# EAGLE design hydrogen_sensors_board_v2 (EAGLE 8.3.2)
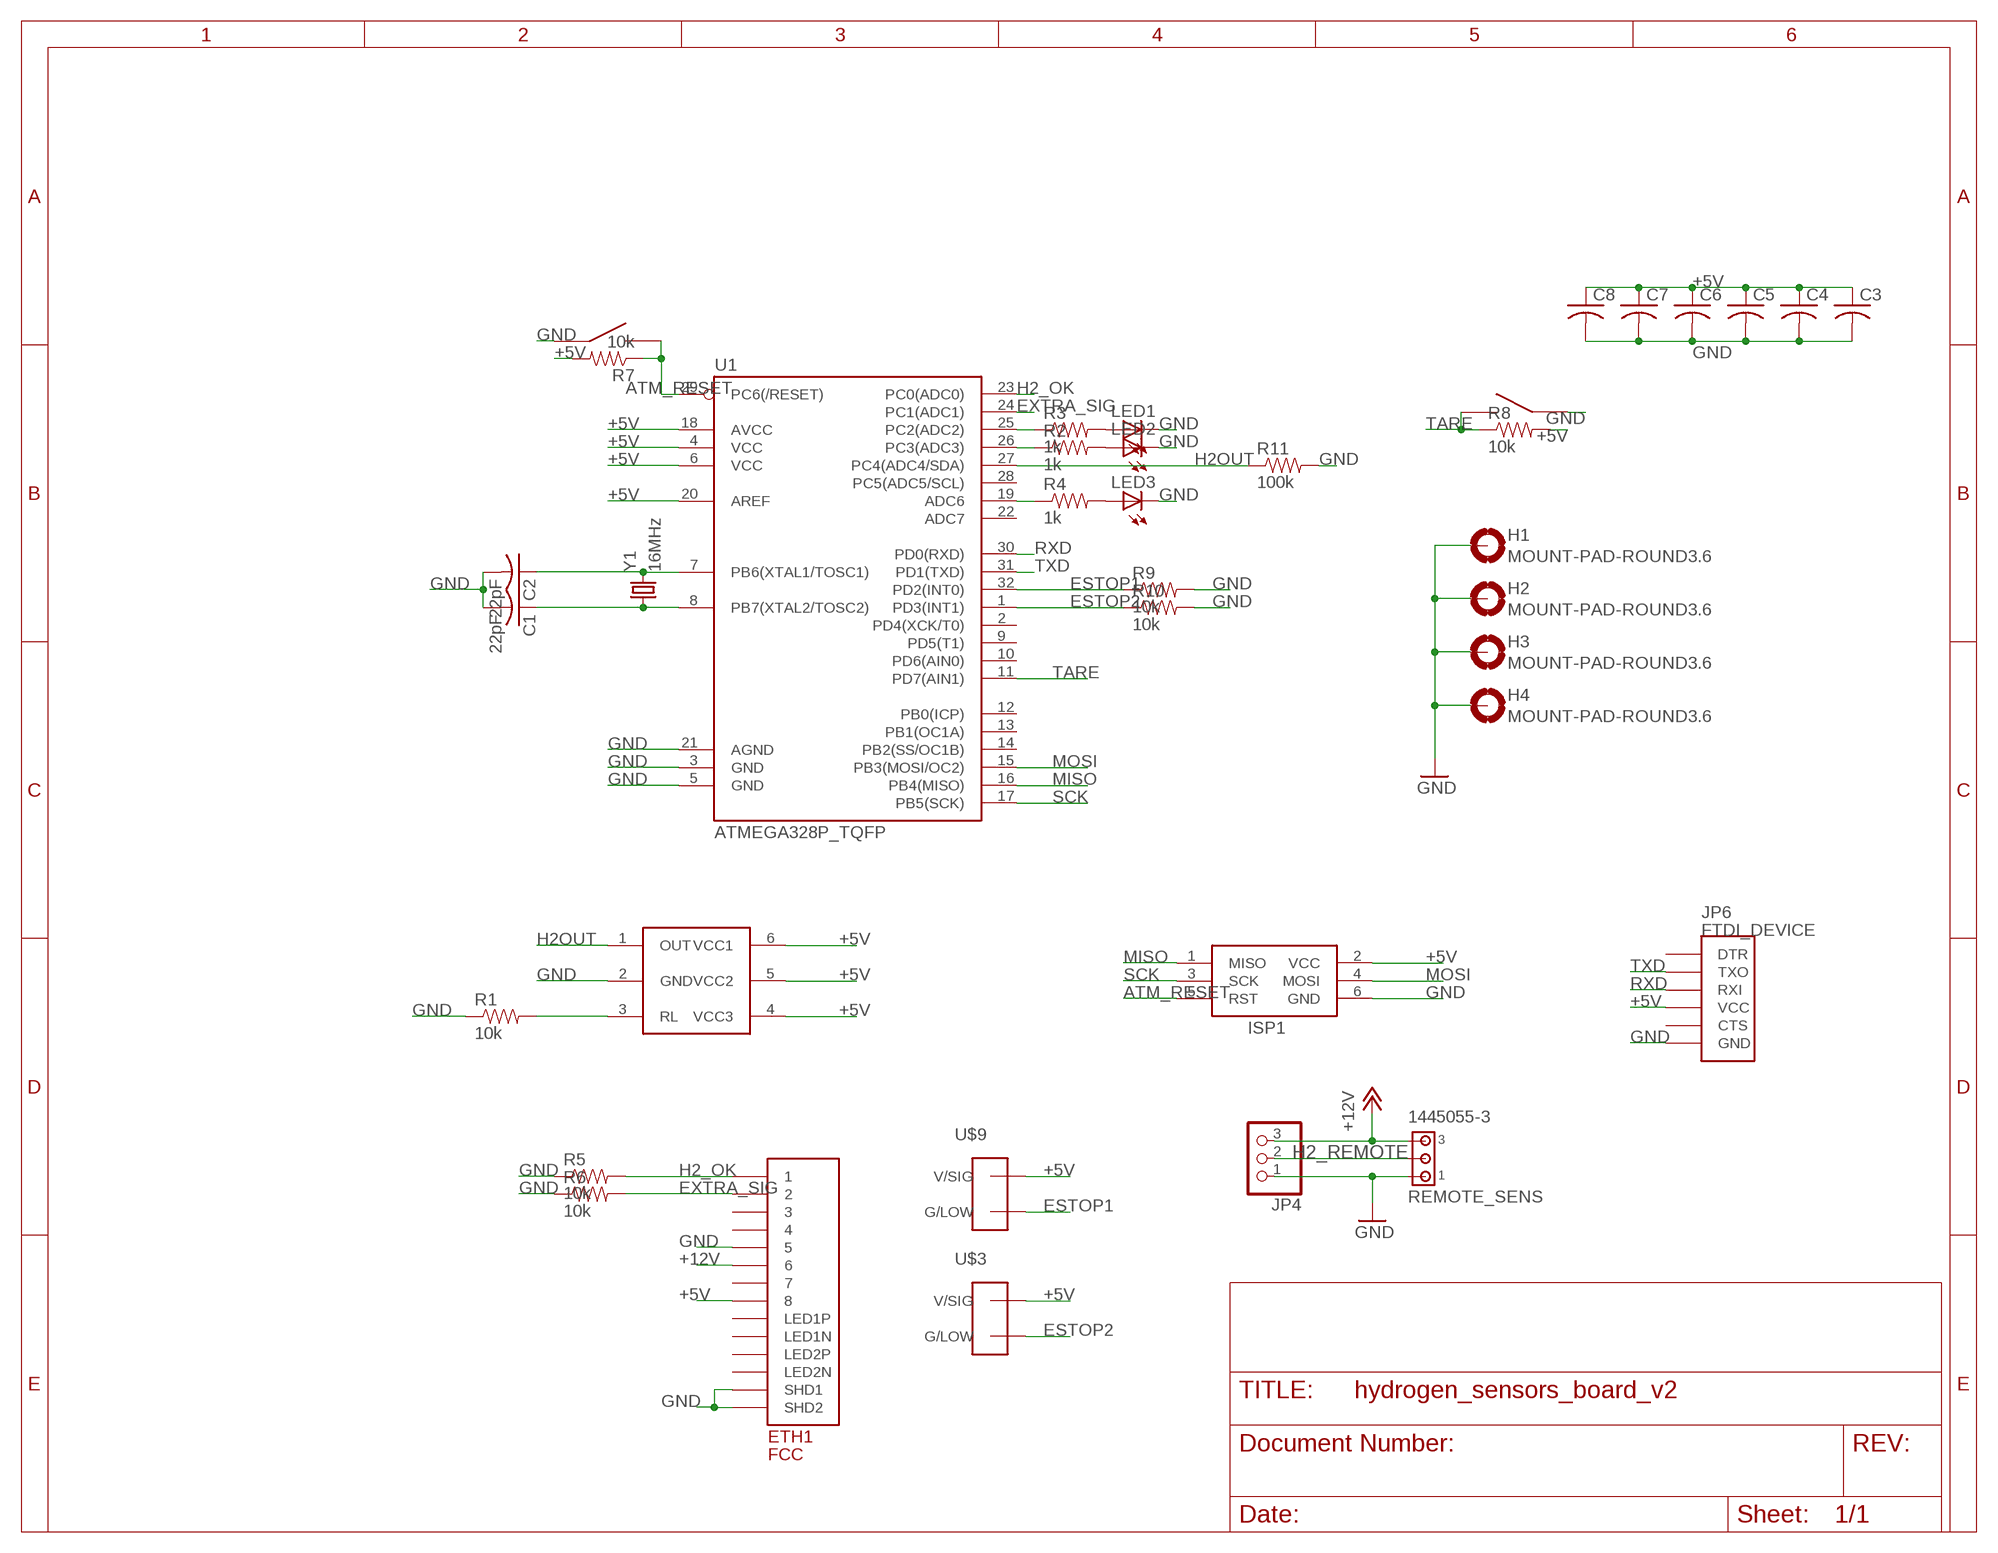
[diagram p0: schematic, sheet 1]

## Parts
C1  22pF  C-USC0603K  [C0603K]
C2  22pF  C-USC0603K  [C0603K]
C3  C-USC0603  [C0603]
C4  C-USC0603  [C0603]
C5  C-USC0603  [C0603]
C6  C-USC0603  [C0603]
C7  C-USC0603  [C0603]
C8  C-USC0603  [C0603]
ETH1  FCC  ETHERNET  [A122645-ND]
H1  MOUNT-PAD-ROUND3.6  [3,6-PAD]
H2  MOUNT-PAD-ROUND3.6  [3,6-PAD]
H3  MOUNT-PAD-ROUND3.6  [3,6-PAD]
H4  MOUNT-PAD-ROUND3.6  [3,6-PAD]
ISP1  AVRISP-BOX  [AVRISP-BOX]
JP4  PINHD-1X3  [1X03]
JP6  FTDI_DEVICE  [FTDI_DEVICE_SIDE]
LED1  LEDCHIPLED_0805  [CHIPLED_0805]
LED2  LEDCHIPLED_0805  [CHIPLED_0805]
LED3  LEDCHIPLED_0805  [CHIPLED_0805]
R1  10k  RESISTOR0603-RES  [0603-RES]
R2  1k  RESISTOR0603-RES  [0603-RES]
R3  1k  RESISTOR0603-RES  [0603-RES]
R4  1k  RESISTOR0603-RES  [0603-RES]
R5  10k  RESISTOR0603-RES  [0603-RES]
R6  10k  RESISTOR0603-RES  [0603-RES]
R7  10k  RESISTOR0603-RES  [0603-RES]
R8  10k  RESISTOR0603-RES  [0603-RES]
R9  10k  RESISTOR0603-RES  [0603-RES]
R10  10k  RESISTOR0603-RES  [0603-RES]
R11  100k  RESISTOR0603-RES  [0603-RES]
REMOTE_SENS  1445055-3  [1445055-3]
U1  ATMEGA328P_TQFP  [TQFP32-08]
U$1  MQ-8MQ-8  [MQ-8]
U$2  EG4621CT-ND  [EG4621CT-ND]
U$3  TE770966  [2X1-MATE-N-LOCK]
U$9  TE770966  [2X1-MATE-N-LOCK]
U$10  EG4621CT-ND  [EG4621CT-ND]
Y1  16MHz  CRYSTALHC49US  [HC49US]

## Nets
+5V: C3.1 C4.1 C5.1 C6.1 C7.1 C8.1 ETH1.P$8 ISP1.2(VCC) JP6.P$4(VCC) R7.2 R8.2 U1.4(VCC) U1.6(VCC) U1.18(AVCC) U1.20(AREF) U$1.4(VCC3) U$1.5(VCC2) U$1.6(VCC1) U$3.CIRCUIT1(V/SIG) U$9.CIRCUIT1(V/SIG)
+12V: ETH1.P$6 JP4.3 REMOTE_SENS.3
ATM_RESET: ISP1.5(RST) R7.1 U1.29(PC6(/RESET)) U$10.P$3 U$10.P$4
ESTOP1: R9.1 U1.32(PD2(INT0)) U$9.CIRCUIT2(G/LOW)
ESTOP2: R10.1 U1.1(PD3(INT1)) U$3.CIRCUIT2(G/LOW)
EXTRA_SIG: ETH1.P$2 R6.2 U1.24(PC1(ADC1))
GND: C1.2 C2.2 C3.2 C4.2 C5.2 C6.2 C7.2 C8.2 ETH1.P$5 ETH1.P$13(SHD1) ETH1.P$14(SHD2) H1.B3,6(MOUNT) H2.B3,6(MOUNT) H3.B3,6(MOUNT) H4.B3,6(MOUNT) ISP1.6(GND) JP4.1 JP6.P$6(GND) LED1.C LED2.C LED3.C R1.1 R5.1 R6.1 R9.2 R10.2 R11.2 REMOTE_SENS.1 U1.3(GND) U1.5(GND) U1.21(AGND) U$1.2(GND) U$2.P$1 U$2.P$2 U$10.P$1 U$10.P$2
H2_OK: ETH1.P$1 R5.2 U1.23(PC0(ADC0))
H2_REMOTE: JP4.2 REMOTE_SENS.2
H2OUT: R11.1 U1.27(PC4(ADC4/SDA)) U$1.1(OUT)
MISO: ISP1.1(MISO) U1.16(PB4(MISO))
MOSI: ISP1.4(MOSI) U1.15(PB3(MOSI/OC2))
N$1: C2.1 U1.7(PB6(XTAL1/TOSC1)) Y1.2
N$2: R1.2 U$1.3(RL)
N$3: C1.1 U1.8(PB7(XTAL2/TOSC2)) Y1.1
N$4: R3.1 U1.25(PC2(ADC2))
N$5: R2.1 U1.26(PC3(ADC3))
N$6: R4.1 U1.19(ADC6)
N$7: LED1.A R3.2
N$8: LED2.A R2.2
N$9: LED3.A R4.2
RXD: JP6.P$3(RXI) U1.30(PD0(RXD))
SCK: ISP1.3(SCK) U1.17(PB5(SCK))
TARE: R8.1 U1.11(PD7(AIN1)) U$2.P$3 U$2.P$4
TXD: JP6.P$2(TXO) U1.31(PD1(TXD))
Unconnected: ETH1.P$3 ETH1.P$4 ETH1.P$7 ETH1.P$9(LED1N) ETH1.P$10(LED1P) ETH1.P$11(LED2N) ETH1.P$12(LED2P) JP6.P$1(DTR) JP6.P$5(CTS) U1.2(PD4(XCK/T0)) U1.9(PD5(T1)) U1.10(PD6(AIN0)) U1.12(PB0(ICP)) U1.13(PB1(OC1A)) U1.14(PB2(SS/OC1B)) U1.22(ADC7) U1.28(PC5(ADC5/SCL))

## Library data of the parts
C1-C8 = adafruit:C-US: CAPACITOR, American symbol
ETH1 = ETHERNET:ETHERNET: Ethernet port with 2 leds. digikey number A122645-ND
H1-H4 = holes:MOUNT-PAD-ROUND: MOUNTING PAD, round
ISP1 = adafruit:AVRISP: AVR ISP HEADER Standard 6 pin header for AVR programming
JP4 = pinhead:PINHD-1X3: PIN HEADER
JP6 = SparkFun-Connectors:FTDI_DEVICE: Connector which mates to FTDI basic or FTDI cable.
LED1-LED3 = adafruit:LED: LED OSRAM: - CHIPLED LG R971, LG N971, LY N971, LG Q971, LY Q971, LO R971, LY R971 LH N974, LH R974 LS Q976, LO Q976, LY Q976 LO Q996 - Hyper CHIPLED LW Q18S LB Q993, LB Q99A, LB R99A - SideLED LS A670, LO A670, LY A670, LG A670, LP A670 LB A673, LV A673, LT A673, LW A673 LH A674 LY A675 LS A676, LA A676, LO A676, LY A676, LW A676 LS A679, LY A679, LG A679 - Hyper Micro SIDELED® LS Y876, LA Y876, LO Y876, LY Y876 LT Y87S - SmartLED LW L88C, LW L88S LB L89C, LB L89S, LG L890 LS L89K, LO L89K, LY L89K LS L896, LA L896, LO L896, LY L896 - TOPLED LS T670, LO T670, LY T670, LG T670, LP T670 LSG T670, LSP T670, LSY T670, LOP T670, LYG T670 LG T671, LOG T671, LSG T671 LB T673, LV T673, LT T673, LW T673 LH T674 LS T676, LA T676, LO T676, LY T676, LB T676, LH T676, LSB T676, LW T676 LB T67C, LV T67C, LT T67C, LS T67K, LO T67K, LY T67K, LW E67C LS E67B, LA E67B, LO E67B, LY E67B, LB E67C, LV E67C, LT E67C LW T67C LS T679, LY T679, LG T679 LS T770, LO T770, LY T770, LG T770, LP T770 LB T773, LV T773, LT T773, LW T773 LH T774 LS E675, LA E675, LY E675, LS T675 LS T776, LA T776, LO T776, LY T776, LB T776 LHGB T686 LT T68C, LB T68C - Hyper Mini TOPLED® LB M676 - Mini TOPLED Santana® LG M470 LS M47K, LO M47K, LY M47K Source: http://www.osram.convergy.de/
R1 R5 R6 R9 R10 = SparkFun-Passives:RESISTOR: Resistor Basic schematic elements and footprints for 0603, 1206, and PTH resistors.
R2-R4 R7 R8 R11 = SparkFun-Resistors:RESISTOR: Resistor Basic schematic elements and footprints for 0603, 1206, and PTH resistors.
REMOTE_SENS = con-amp:1445055-3: Micro MATE-N-LOK Connectors grid 1.5 mm Source: ENG_CD_1445055_A.pdf
U1 = SparkFun-DigitalIC:ATMEGA328P_TQFP; PROD_ID: IC-09069
U$1 = donny_library:MQ-8
U$2 U$10 = EG4621CT-ND:EG4621CT-ND: surface mount push putton digikey number EG4621CT-ND
U$3 U$9 = Shell2013:TE770966
Y1 = SparkFun-FreqCtrl:CRYSTAL: Various standard crystals. Proven footprints.

## Board
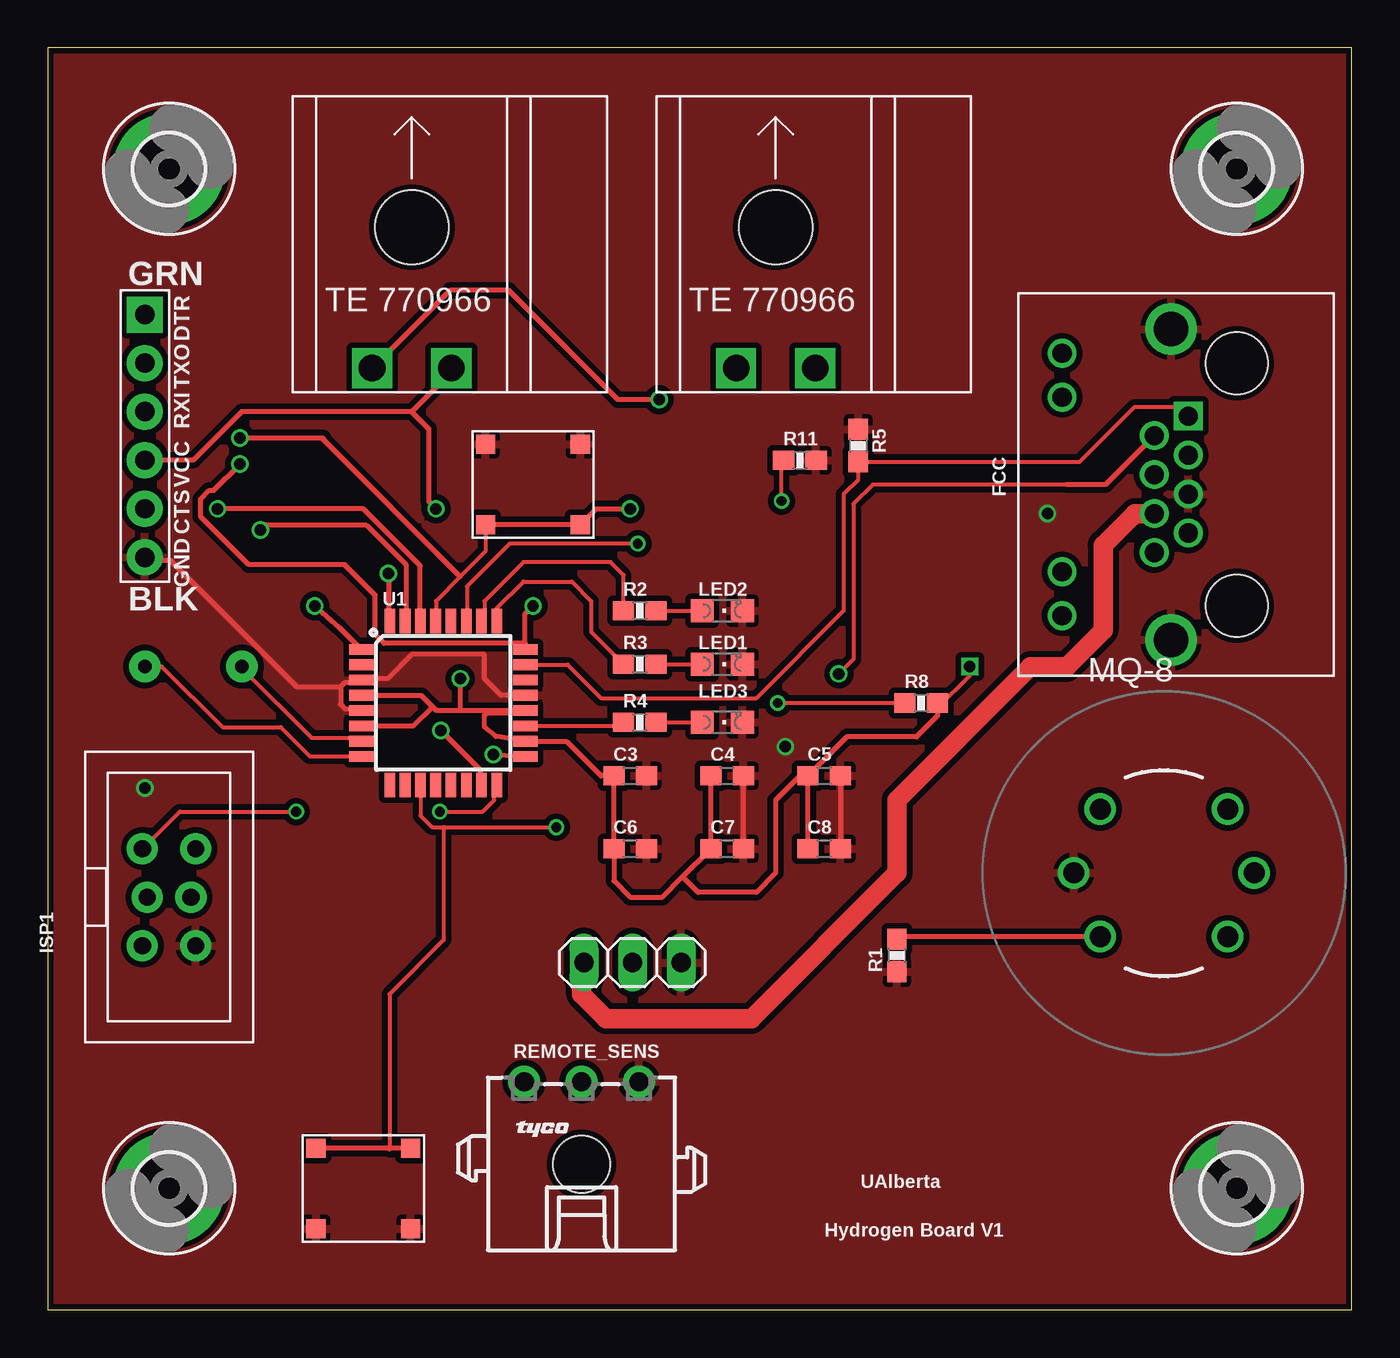
[diagram p1: board, top side]
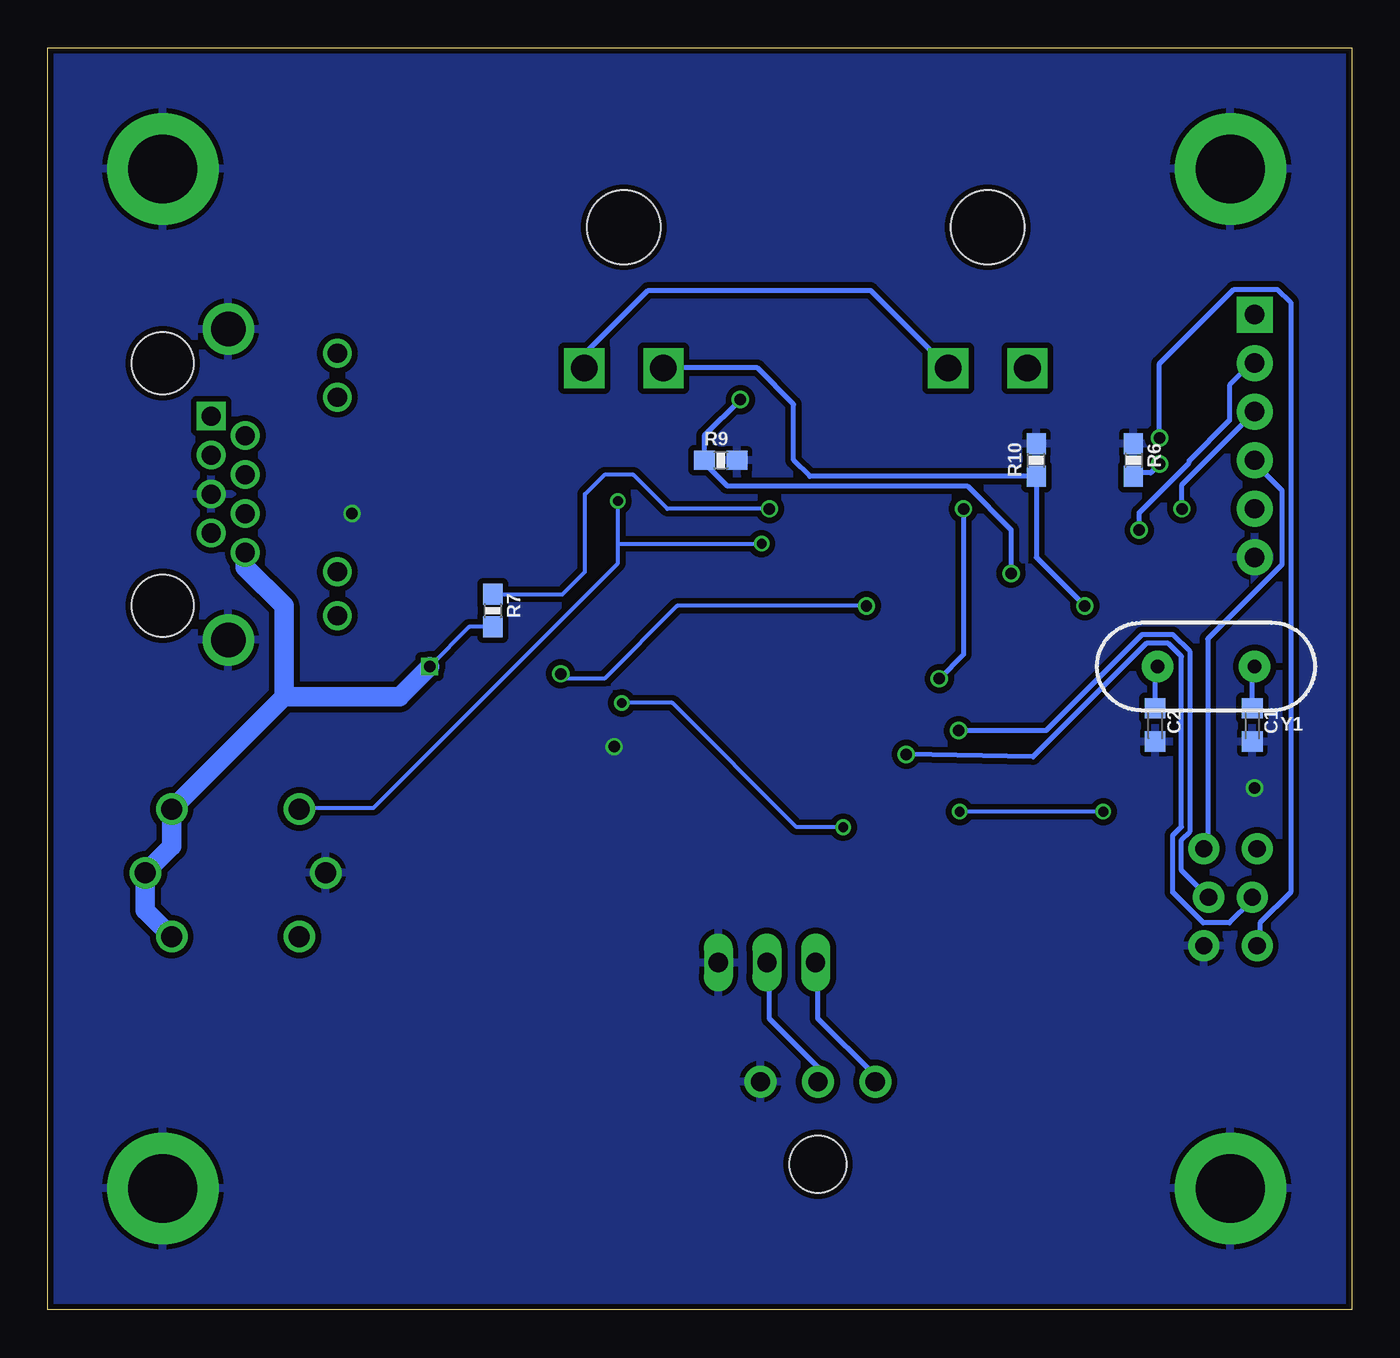
[diagram p2: board, bottom side, seen from below]

Size 68.25 x 66.03 mm. Coordinates in mm from the lower left corner, seen from the top.
Outline: 0,0 68.25,0 68.25,66.03 0,66.03 0,0
Copper layers (1*16): Top 0.035mm / dielectric 1.5mm / Bottom 0.035mm
Design rules "SeeedStudio_2layer_DRU_no_angle_20140221": minimum track width 6mil, minimum drill 12mil, track to track 6mil, track to pad 6mil, pad to pad 6mil, via to via 6mil, smd to smd 0mil, copper to edge 10mil, drill to drill 10mil, minimum pad ring 10mil, minimum via ring 6mil, stop-mask expansion 2mil, vias tented up to drill 100mil, thermal gap 10mil

### Footprints (pad centres in the part's own frame; a part is rotated, then mirrored left to right if it is on the bottom)
C0603K = smd 1.05 x 1.08: 1 -0.875,0; 2 0.875,0
C0603 = smd 1.1 x 1: 1 -0.85,0; 2 0.85,0
A122645-ND = drill 1 square: P$1 3.58,2.54 | drill 1: P$2 2.56,4.32; P$3 1.54,2.54; P$4 0.52,4.32; P$5 -0.5,2.54; P$6 -1.52,4.32; P$7 -2.54,2.54; P$8 -3.56,4.32; P$9 -6.86,9.14; P$10 -4.57,9.14; P$11 4.57,9.14; P$12 6.86,9.14 | drill 1.8: P$13 -8.13,3.43; P$14 8.13,3.43 | hole 3.25: -6.35,0; 6.35,0
3,6-PAD = drill 3.6 pad 5.842: B3,6 0,0
AVRISP-BOX = drill 0.9 pad 1.626: 1 -1.397,2.54; 2 1.397,2.54; 3 -1.143,0; 4 1.143,0; 5 -1.397,-2.54; 6 1.397,-2.54
1X03 = drill 1.016 long: 1 -2.54,0; 2 0,0; 3 2.54,0
FTDI_DEVICE_SIDE = drill 1.016 pad 1.88 square: P$1 -6.35,0 | drill 1.016 pad 1.88: P$2 -3.81,0; P$3 -1.27,0; P$4 1.27,0; P$5 3.81,0; P$6 6.35,0
CHIPLED_0805 = smd 1.2 x 1.2: A 0,-1.05; C 0,1.05
0603-RES = smd 1.1 x 1: 1 -0.85,0; 2 0.85,0
1445055-3 = drill 1 pad 1.676: 1 3,4.32; 2 0,4.32; 3 -3,4.32 | hole 3: 0,0
TQFP32-08 = smd 1.27 x 0.559: 1 -4.293,2.8; 2 -4.293,2; 3 -4.293,1.2; 4 -4.293,0.4; 5 -4.293,-0.4; 6 -4.293,-1.2; 7 -4.293,-2; 8 -4.293,-2.8; 17 4.293,-2.8; 18 4.293,-2; 19 4.293,-1.2; 20 4.293,-0.4; 21 4.293,0.4; 22 4.293,1.2; 23 4.293,2; 24 4.293,2.8 | smd 0.559 x 1.27: 9 -2.8,-4.293; 10 -2,-4.293; 11 -1.2,-4.293; 12 -0.4,-4.293; 13 0.4,-4.293; 14 1.2,-4.293; 15 2,-4.293; 16 2.8,-4.293; 25 2.8,4.293; 26 2,4.293; 27 1.2,4.293; 28 0.4,4.293; 29 -0.4,4.293; 30 -1.2,4.293; 31 -2,4.293; 32 -2.8,4.293
MQ-8 = drill 1.1: 1 -3.337,3.337; 2 -4.72,0; 3 -3.337,-3.337; 4 3.337,-3.337; 5 4.72,0; 6 3.337,3.337
EG4621CT-ND = smd 1 x 1: P$1 -2.475,2.1; P$2 2.475,2.1; P$3 -2.475,-2.1; P$4 2.475,-2.1
2X1-MATE-N-LOCK = drill 1.4 square: CIRCUIT1 -2.07,14.23; CIRCUIT2 2.07,14.23 | hole 3.86: 0,6.86
HC49US = drill 0.7 pad 1.651: 1 -2.54,0; 2 2.54,0

### Placement (x,y rotation side)
C1  5.21,30.61 270 bottom
C2  10.29,30.61 270 bottom
C3  30.48,27.94 0 top
C4  35.56,27.94 0 top
C5  40.64,27.94 0 top
C6  30.48,24.13 0 top
C7  35.56,24.13 0 top
C8  40.64,24.13 0 top
ETH1  62.23,43.18 90 top
H1  6.35,59.69 0 top
H2  62.23,59.69 0 top
H3  62.23,6.35 0 top
H4  6.35,6.35 0 top
ISP1  6.35,21.59 0 top
JP4  30.61,18.16 180 top
JP6  5.08,45.72 270 top
LED1  35.31,33.78 270 top
LED2  35.31,36.58 270 top
LED3  35.31,30.73 270 top
R1  44.45,18.54 90 top
R2  30.99,36.58 0 top
R3  30.99,33.78 0 top
R4  30.99,30.73 0 top
R5  42.42,45.21 270 top
R6  11.43,44.45 270 bottom
R7  44.96,36.58 270 bottom
R8  45.72,31.75 0 top
R9  33.02,44.45 0 bottom
R10  16.51,44.45 90 bottom
R11  39.37,44.45 0 top
REMOTE_SENS  27.94,7.62 0 top
U1  20.7,31.75 0 top
U$1  58.42,22.86 0 top
U$2  16.51,6.35 180 top
U$3  38.1,63.5 180 top
U$9  19.05,63.5 180 top
U$10  25.4,43.18 0 top
Y1  7.62,33.66 180 bottom

### Tracks (layer width: path | path; a pad name or v marks a point on that pad's centre or on a via)
+5V  (via drill 0.6)
  Top 0.203: v48.26,33.66 48.26,33.19 46.57,31.5
  Top 0.254: U$9.CIRCUIT1 21.12,49.06 19.05,46.99 | 19.05,46.99 10.16,46.99 7.62,44.45 JP6.P$4 | 21.59,31.35 U1.20 24.89,31.24 22.99,31.24 22.86,31.11 22.86,30.48 23.46,30 U1.18 25.03,29.72 27.18,29.72 28.96,27.94 C3.1 C6.1 29.63,22.44 30.48,21.59 32.17,21.59 33.23,22.65 | 21.59,31.35 20.34,31.35 20.13,31.56 | 20.13,31.56 19.56,32.13 16.43,32.13 U1.4 | U1.6 19.12,30.55 20.13,31.56 | 19.05,46.99 19.94,46.1 19.94,42.29 v20.32,41.91 | v21.59,33.02 21.59,31.35 | R8.2 46.57,31.5 46.57,31.08 45.47,29.97 41.82,29.97 C5.1 | C8.1 C5.1 | C4.1 C7.1 33.23,22.65 | C5.1 39.37,27.94 38.1,26.67 38.1,22.86 37.08,21.84 34.04,21.84 33.23,22.65
  Bottom 0.203: R7.2 46.19,35.73 v48.26,33.66
  Bottom 0.254: U$3.CIRCUIT1 40.17,50 36.83,53.34 25.19,53.34 U$9.CIRCUIT1 | v20.32,41.91 20.32,34.29 v21.59,33.02 | ISP1.2 7.54,24.13 7.54,35.1 3.66,38.99 3.66,42.88 5.03,44.25 JP6.P$4
  Bottom 1.016: ETH1.P$8 57.91,38.86 55.88,36.83 55.88,32.08 | 55.88,32.08 U$1.6 61.76,24.24 U$1.5 63.14,20.91 U$1.4 | 55.88,32.08 49.84,32.08 v48.26,33.66
+12V
  Top 1.016: ETH1.P$6 56.9,41.66 55.24,40.01 55.24,35.56 53.34,33.66 51.44,33.66 44.45,26.67 44.45,22.86 36.83,15.24 29.21,15.24 27.94,16.51 27.94,18.03 JP4.3
  Bottom 0.254: REMOTE_SENS.3 24.94,12.24 27.94,15.24 27.94,18.03 JP4.3
ATM_RESET  (via drill 0.6, 0.61)
  Top 0.203: U$10.P$3 22.93,39.69 21.59,38.35 20.32,37.08 20.32,36.06 U1.29
  Top 0.254: U$10.P$3 U$10.P$4 28.7,41.91 v30.48,41.91 | v10.06,45.62 14.4,45.62 14.4,45.54 21.59,38.35
  Bottom 0.203: v30.48,41.91 35.81,41.91 37.59,43.69 39.12,43.69 40.13,42.67 40.13,38.61 41.31,37.43 R7.1
  Bottom 0.254: v10.06,45.62 10.06,49.51 6.17,53.39 3.89,53.39 3.2,52.7 3.2,21.84 4.8,20.24 4.8,19.1 ISP1.5
ESTOP1  (via drill 0.6, 0.61)
  Top 0.254: v32,47.62 29.84,47.62 24.13,53.34 21.05,53.34 U$9.CIRCUIT2 | v17.83,38.53 17.83,36.25 U1.32
  Bottom 0.254: v32,47.62 33.87,45.76 R9.1 33.83,44.25 32.69,43.1 20.12,43.1 17.83,40.82 v17.83,38.53
ESTOP2  (via drill 0.6)
  Top 0.254: v13.97,36.83 15.24,35.72 U1.1
  Bottom 0.254: U$3.CIRCUIT2 31.11,49.28 29.21,47.37 29.21,44.45 28.36,43.6 R10.1 16.51,39.37 v13.97,36.83
EXTRA_SIG  (via drill 0.6, 0.61)
  Top 0.203: 53.34,43.18 43.18,43.18 42.16,42.16 42.16,34.04 v41.4,33.27
  Top 0.254: U1.24 24.99,34.87 | 24.99,34.87 24.99,36.42 v25.4,36.83 | 53.34,43.18 55.35,43.18 ETH1.P$2 | v10.06,44.25 8.69,42.88 8.46,42.88 8,42.42 8,41.5 10.52,38.99 15.54,38.99 17.14,37.39 17.14,35.33 17.6,34.87 24.99,34.87
  Bottom 0.203: v25.4,36.83 35.31,36.83 39.12,33.02 41.15,33.02 v41.4,33.27
  Bottom 0.254: v10.06,44.25 10.52,43.79 11.43,43.79 R6.2
GND  (via drill 0.6 pad 0.75)
  Top 0.254: U1.21 23.73,32.15 22.86,33.02 22.86,34.29 19.05,34.29 17.78,33.02 16.48,33.02 U1.3 16.23,32.82 15.54,32.82 15.32,32.59 | 15.32,32.59 15.32,31.67 15.54,31.45 16.23,31.45 U1.5 | 15.32,32.59 13.03,32.59 6.4,39.22 5.26,39.22 JP6.P$6 | C5.2 C8.2 | C7.2 C4.2
  other vias: 5.08,27.3 52.32,41.66 38.61,29.46
  pour Top (isolate 0.305): 0,0 0,66.04 68.58,66.04 68.58,0
  pour Bottom (isolate 0.305): 0,0 0,66.04 70.48,66.04 70.48,0
H2_OK
  Top 0.203: U1.23 27.21,33.75 28.96,32 37.08,32 41.66,36.58 41.66,42.67 42.42,43.43 R5.2 54.01,44.36 56.9,47.24 59.21,47.24 ETH1.P$1
H2_REMOTE
  Bottom 0.254: REMOTE_SENS.2 27.94,12.7 30.48,15.24 30.48,18.03 JP4.2
H2OUT  (via drill 0.51)
  Top 0.203: v38.41,42.32 38.41,44.35 R11.1 | v30.89,40.08 24.18,40.08 21.95,37.85 21.95,36.22 U1.27
  Bottom 0.203: 38.41,40.08 38.41,39.06 51.21,26.26 55.07,26.26 U$1.1 | 38.41,40.08 v38.41,42.32 | 38.41,40.08 v30.89,40.08
MISO  (via drill 0.51)
  Top 0.203: v20.52,26.06 22.76,26.06 23.37,26.67 23.37,27.28 U1.16 | v13.01,26.06 6.91,26.06 5.08,24.23 ISP1.1
  Bottom 0.203: v13.01,26.06 v20.52,26.06
MOSI  (via drill 0.61)
  Top 0.254: v20.57,30.3 22.63,28.25 22.63,27.56 U1.15
  Bottom 0.254: v20.57,30.3 16,30.3 10.97,35.33 9.37,35.33 8.46,34.42 8.46,25.04 8.91,24.59 8.91,22.99 7.54,21.61 ISP1.4
N$1
  Top 0.203: U1.7 16.26,29.92 13.82,29.92 10.16,33.58 Y1.2
  Bottom 0.254: C2.1 10.29,33.53 Y1.2
N$2
  Top 0.254: U$1.3 44.58,19.52 R1.2
  Bottom 0.203: 55.07,19.56 U$1.3
N$3
  Top 0.203: Y1.1 5.97,33.66 9.14,30.48 12.19,30.48 13.72,28.96 U1.8
  Bottom 0.254: C1.1 5.21,33.53 Y1.1
N$4
  Top 0.203: U1.25 23.5,36.71 24.89,38.1 27.43,38.1 28.45,37.08 28.45,35.47 R3.1
N$5
  Top 0.203: R2.1 30.14,38.44 29.46,39.12 24.89,39.12 22.86,37.08 22.86,36.2 U1.26
N$6
  Top 0.203: U1.19 29.95,30.55 R4.1
N$7
  Top 0.203: R3.2 LED1.A
N$8
  Top 0.203: R2.2 LED2.A
N$9
  Top 0.203: R4.2 LED3.A
RXD  (via drill 0.6)
  Top 0.254: U1.30 19.5,38.92 16.51,41.91 v8.89,41.91
  Bottom 0.254: v8.89,41.91 8.89,43.18 JP6.P$3
SCK  (via drill 0.61)
  Top 0.254: v23.32,29.06 24.92,28.93 U1.17
  Bottom 0.254: v23.32,29.06 16.69,28.93 10.74,34.87 9.6,34.87 8.91,34.19 8.91,25.27 9.37,24.82 9.37,21.84 7.77,20.24 6.4,20.24 5.26,21.39 ISP1.3
TARE  (via drill 0.51)
  Top 0.203: v38.2,31.75 R8.1 | 20.73,25.25 20.12,25.25 19.51,25.86 19.51,27.28 U1.11 | 20.73,25.25 v26.62,25.25 | 20.73,25.25 20.73,19.36 17.88,16.51 17.88,8.45 17.88,8.38
  Top 0.254: U$2.P$3 17.88,8.45 U$2.P$4
  Bottom 0.203: v38.2,31.75 35.56,31.75 29.06,25.25 v26.62,25.25
TXD  (via drill 0.61)
  Top 0.254: U1.31 18.75,36.25 18.75,38.99 16.69,41.05 11.38,41.05 v11.12,40.79
  Bottom 0.254: JP6.P$2 5.26,49.51 6.4,48.36 6.4,46.53 8.51,44.42 8.51,44.32 11.12,41.71 v11.12,40.79

### Text on the board
tPlace: UAlberta | Hydrogen Board V1